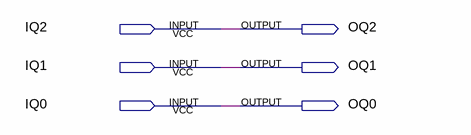
[diagram p0: schematic sheet]
// Quartus schematic MEF_funcion_de_salida.bdf as structural Verilog: 0 symbols, 6 pins
module MEF_funcion_de_salida (
  input  IQ2,
  input  IQ1,
  input  IQ0,
  output OQ2,
  output OQ1,
  output OQ0
);


  assign OQ0 = IQ0;
  assign OQ1 = IQ1;
  assign OQ2 = IQ2;
endmodule
